# Altium schematic sheet foxbms2-interface-ltc6820.SchDoc
size A3; DocumentNumber: 1; SheetNumber: 1; SheetTotal: 3; SheetDescription: isoSPI Communication
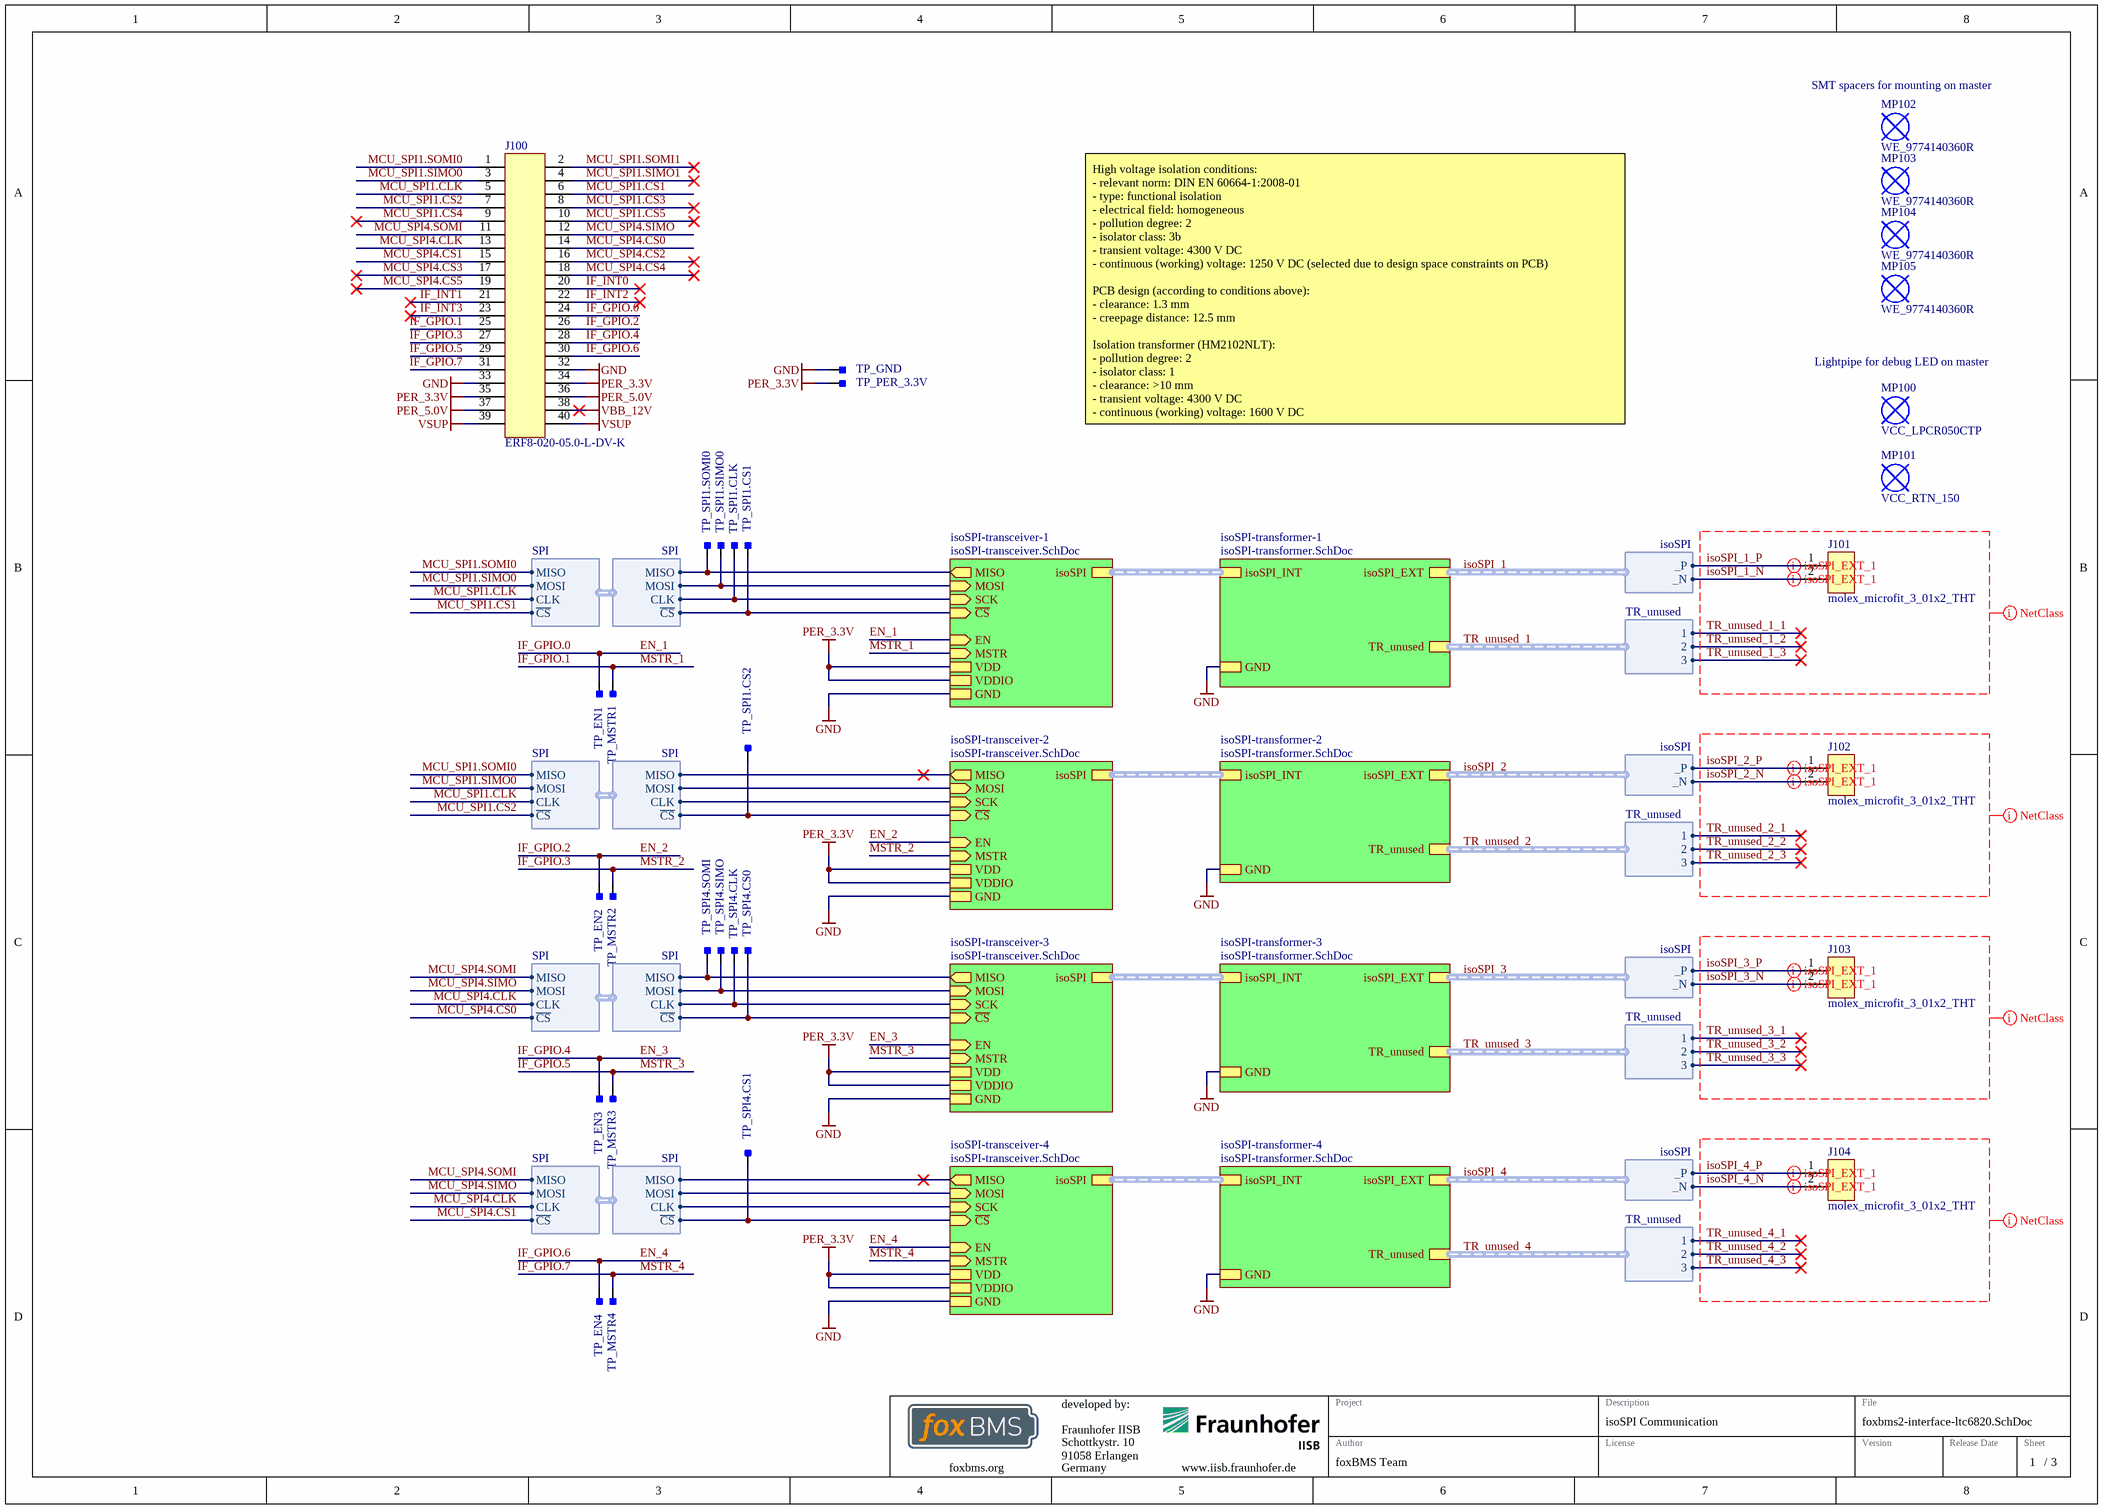
[diagram p0: foxbms2-interface-ltc6820.SchDoc]

## Parts
J100  ERF8-020-05.0-L-DV-K  [SAMTEC_ERF8-020-05.0-L-DV-K]
J101  molex_microfit_3_01x2_THT  [MOLEX_MICROFIT_01x2_THT]
J102  molex_microfit_3_01x2_THT  [MOLEX_MICROFIT_01x2_THT]
J103  molex_microfit_3_01x2_THT  [MOLEX_MICROFIT_01x2_THT]
J104  molex_microfit_3_01x2_THT  [MOLEX_MICROFIT_01x2_THT]
MP100  VCC_LPCR050CTP  [VCC_LPCR050TP]  (mechanical)
MP101  VCC_RTN_150  [VCC_RTN_150]  (mechanical)
MP102  WE_9774140360R  [WE_9774140360]
MP103  WE_9774140360R  [WE_9774140360]
MP104  WE_9774140360R  [WE_9774140360]
MP105  WE_9774140360R  [WE_9774140360]
TP_EN1  Testpoint_Square  [Testpoint_S1]  (value not drawn)  (no BOM)
TP_EN2  Testpoint_Square  [Testpoint_S1]  (value not drawn)  (no BOM)
TP_EN3  Testpoint_Square  [Testpoint_S1]  (value not drawn)  (no BOM)
TP_EN4  Testpoint_Square  [Testpoint_S1]  (value not drawn)  (no BOM)
TP_GND  Testpoint_Square  [Testpoint_S1]  (value not drawn)  (no BOM)
TP_MSTR1  Testpoint_Square  [Testpoint_S1]  (value not drawn)  (no BOM)
TP_MSTR2  Testpoint_Square  [Testpoint_S1]  (value not drawn)  (no BOM)
TP_MSTR3  Testpoint_Square  [Testpoint_S1]  (value not drawn)  (no BOM)
TP_MSTR4  Testpoint_Square  [Testpoint_S1]  (value not drawn)  (no BOM)
TP_PER_3.3V  Testpoint_Square  [Testpoint_S1]  (value not drawn)  (no BOM)
TP_SPI1.CLK  Testpoint_Square  [Testpoint_S1]  (value not drawn)  (no BOM)
TP_SPI1.CS1  Testpoint_Square  [Testpoint_S1]  (value not drawn)  (no BOM)
TP_SPI1.CS2  Testpoint_Square  [Testpoint_S1]  (value not drawn)  (no BOM)
TP_SPI1.SIMO0  Testpoint_Square  [Testpoint_S1]  (value not drawn)  (no BOM)
TP_SPI1.SOMI0  Testpoint_Square  [Testpoint_S1]  (value not drawn)  (no BOM)
TP_SPI4.CLK  Testpoint_Square  [Testpoint_S1]  (value not drawn)  (no BOM)
TP_SPI4.CS0  Testpoint_Square  [Testpoint_S1]  (value not drawn)  (no BOM)
TP_SPI4.CS1  Testpoint_Square  [Testpoint_S1]  (value not drawn)  (no BOM)
TP_SPI4.SIMO  Testpoint_Square  [Testpoint_S1]  (value not drawn)  (no BOM)
TP_SPI4.SOMI  Testpoint_Square  [Testpoint_S1]  (value not drawn)  (no BOM)

## Sub-sheets
isoSPI-transceiver-1 = isoSPI-transceiver.SchDoc: GND, VDDIO, MISO (out), SCK (in), EN (in), ~{CS} (in), VDD, MOSI (in), MSTR (in), isoSPI (harness isoSPI)
isoSPI-transceiver-2 = isoSPI-transceiver.SchDoc: GND, VDDIO, MISO (out), SCK (in), EN (in), ~{CS} (in), VDD, MOSI (in), MSTR (in), isoSPI (harness isoSPI)
isoSPI-transceiver-3 = isoSPI-transceiver.SchDoc: GND, VDDIO, MISO (out), SCK (in), EN (in), ~{CS} (in), VDD, MOSI (in), MSTR (in), isoSPI (harness isoSPI)
isoSPI-transceiver-4 = isoSPI-transceiver.SchDoc: GND, VDDIO, MISO (out), SCK (in), EN (in), ~{CS} (in), VDD, MOSI (in), MSTR (in), isoSPI (harness isoSPI)
isoSPI-transformer-1 = isoSPI-transformer.SchDoc: GND, isoSPI_INT (harness isoSPI), isoSPI_EXT (harness isoSPI), TR_unused (harness TR_unused)
isoSPI-transformer-2 = isoSPI-transformer.SchDoc: GND, isoSPI_INT (harness isoSPI), isoSPI_EXT (harness isoSPI), TR_unused (harness TR_unused)
isoSPI-transformer-3 = isoSPI-transformer.SchDoc: GND, isoSPI_INT (harness isoSPI), isoSPI_EXT (harness isoSPI), TR_unused (harness TR_unused)
isoSPI-transformer-4 = isoSPI-transformer.SchDoc: GND, isoSPI_INT (harness isoSPI), isoSPI_EXT (harness isoSPI), TR_unused (harness TR_unused)

## Harnesses
SPI: CLK, MOSI, MISO, ~{CS}
isoSPI: _P, _N
TR_unused: 1, 2, 3

## Nets
GND: J100.32 J100.33 TP_GND.1 ; sheet isoSPI-transceiver-1/GND, sheet isoSPI-transformer-1/GND, sheet isoSPI-transceiver-2/GND, sheet isoSPI-transformer-2/GND, sheet isoSPI-transceiver-3/GND, sheet isoSPI-transformer-3/GND, sheet isoSPI-transceiver-4/GND, sheet isoSPI-transformer-4/GND
PER_3.3V: J100.34 J100.35 TP_PER_3.3V.1 ; sheet isoSPI-transceiver-1/VDDIO, sheet isoSPI-transceiver-1/VDD, sheet isoSPI-transceiver-2/VDDIO, sheet isoSPI-transceiver-2/VDD, sheet isoSPI-transceiver-3/VDDIO, sheet isoSPI-transceiver-3/VDD, sheet isoSPI-transceiver-4/VDDIO, sheet isoSPI-transceiver-4/VDD
PER_5.0V: J100.36 J100.37
VBB_12V: J100.38
VSUP: J100.39 J100.40
~{IF_INT0}: J100.20
~{IF_INT1}: J100.21
~{IF_INT2}: J100.22
~{IF_INT3}: J100.23
~{MCU_SPI1.CS1}: J100.6 TP_SPI1.CS1.1 ; sheet isoSPI-transceiver-1/~{CS}, harness SPI.~{CS}
~{MCU_SPI1.CS2}: J100.7 TP_SPI1.CS2.1 ; sheet isoSPI-transceiver-2/~{CS}, harness SPI.~{CS}
~{MCU_SPI1.CS3}: J100.8
~{MCU_SPI1.CS4}: J100.9
~{MCU_SPI1.CS5}: J100.10
~{MCU_SPI4.CS0}: J100.14 TP_SPI4.CS0.1 ; sheet isoSPI-transceiver-3/~{CS}, harness SPI.~{CS}
~{MCU_SPI4.CS1}: J100.15 TP_SPI4.CS1.1 ; sheet isoSPI-transceiver-4/~{CS}, harness SPI.~{CS}
~{MCU_SPI4.CS2}: J100.16
~{MCU_SPI4.CS3}: J100.17
~{MCU_SPI4.CS4}: J100.18
~{MCU_SPI4.CS5}: J100.19
EN_1: J100.24 TP_EN1.1 ; sheet isoSPI-transceiver-1/EN  [also labelled IF_GPIO.0]
EN_2: J100.26 TP_EN2.1 ; sheet isoSPI-transceiver-2/EN  [also labelled IF_GPIO.2]
EN_3: J100.28 TP_EN3.1 ; sheet isoSPI-transceiver-3/EN  [also labelled IF_GPIO.4]
EN_4: J100.30 TP_EN4.1 ; sheet isoSPI-transceiver-4/EN  [also labelled IF_GPIO.6]
IF_GPIO.1: J100.25 TP_MSTR1.1 ; sheet isoSPI-transceiver-1/MSTR  [also labelled MSTR_1]
IF_GPIO.3: J100.27 TP_MSTR2.1 ; sheet isoSPI-transceiver-2/MSTR  [also labelled MSTR_2]
IF_GPIO.5: J100.29 TP_MSTR3.1 ; sheet isoSPI-transceiver-3/MSTR  [also labelled MSTR_3]
IF_GPIO.7: J100.31 TP_MSTR4.1 ; sheet isoSPI-transceiver-4/MSTR  [also labelled MSTR_4]
isoSPI_1_N: J101.2 ; sheet isoSPI-transformer-1/isoSPI_EXT._N  [project net isoSPI_1._N]
isoSPI_1_P: J101.1 ; sheet isoSPI-transformer-1/isoSPI_EXT._P  [project net isoSPI_1._P]
isoSPI_2_N: J102.2 ; sheet isoSPI-transformer-2/isoSPI_EXT._N  [project net isoSPI_2._N]
isoSPI_2_P: J102.1 ; sheet isoSPI-transformer-2/isoSPI_EXT._P  [project net isoSPI_2._P]
isoSPI_3_N: J103.2 ; sheet isoSPI-transformer-3/isoSPI_EXT._N  [project net isoSPI_3._N]
isoSPI_3_P: J103.1 ; sheet isoSPI-transformer-3/isoSPI_EXT._P  [project net isoSPI_3._P]
isoSPI_4_N: J104.2 ; sheet isoSPI-transformer-4/isoSPI_EXT._N  [project net isoSPI_4._N]
isoSPI_4_P: J104.1 ; sheet isoSPI-transformer-4/isoSPI_EXT._P  [project net isoSPI_4._P]
MCU_SPI1.CLK: J100.5 TP_SPI1.CLK.1 ; sheet isoSPI-transceiver-1/SCK, sheet isoSPI-transceiver-2/SCK, harness SPI.CLK
MCU_SPI1.SIMO0: J100.3 TP_SPI1.SIMO0.1 ; sheet isoSPI-transceiver-1/MOSI, sheet isoSPI-transceiver-2/MOSI, harness SPI.MOSI
MCU_SPI1.SIMO1: J100.4
MCU_SPI1.SOMI0: J100.1 TP_SPI1.SOMI0.1 ; sheet isoSPI-transceiver-1/MISO, sheet isoSPI-transceiver-2/MISO, harness SPI.MISO
MCU_SPI1.SOMI1: J100.2
MCU_SPI4.CLK: J100.13 TP_SPI4.CLK.1 ; sheet isoSPI-transceiver-3/SCK, sheet isoSPI-transceiver-4/SCK, harness SPI.CLK
MCU_SPI4.SIMO: J100.12 TP_SPI4.SIMO.1 ; sheet isoSPI-transceiver-3/MOSI, sheet isoSPI-transceiver-4/MOSI, harness SPI.MOSI
MCU_SPI4.SOMI: J100.11 TP_SPI4.SOMI.1 ; sheet isoSPI-transceiver-3/MISO, sheet isoSPI-transceiver-4/MISO, harness SPI.MISO
TR_unused_1_1: sheet isoSPI-transformer-1/TR_unused.1  [project net TR_unused_1.1]
TR_unused_1_2: sheet isoSPI-transformer-1/TR_unused.2  [project net TR_unused_1.2]
TR_unused_1_3: sheet isoSPI-transformer-1/TR_unused.3  [project net TR_unused_1.3]
TR_unused_2_1: sheet isoSPI-transformer-2/TR_unused.1  [project net TR_unused_2.1]
TR_unused_2_2: sheet isoSPI-transformer-2/TR_unused.2  [project net TR_unused_2.2]
TR_unused_2_3: sheet isoSPI-transformer-2/TR_unused.3  [project net TR_unused_2.3]
TR_unused_3_1: sheet isoSPI-transformer-3/TR_unused.1  [project net TR_unused_3.1]
TR_unused_3_2: sheet isoSPI-transformer-3/TR_unused.2  [project net TR_unused_3.2]
TR_unused_3_3: sheet isoSPI-transformer-3/TR_unused.3  [project net TR_unused_3.3]
TR_unused_4_1: sheet isoSPI-transformer-4/TR_unused.1  [project net TR_unused_4.1]
TR_unused_4_2: sheet isoSPI-transformer-4/TR_unused.2  [project net TR_unused_4.2]
TR_unused_4_3: sheet isoSPI-transformer-4/TR_unused.3  [project net TR_unused_4.3]

## Buses and harness runs
harness isoSPI_1 = sheet isoSPI-transformer-1/isoSPI_EXT
harness isoSPI_2 = sheet isoSPI-transformer-2/isoSPI_EXT
harness isoSPI_3 = sheet isoSPI-transformer-3/isoSPI_EXT
harness isoSPI_4 = sheet isoSPI-transformer-4/isoSPI_EXT
harness sheet isoSPI-transceiver-1/isoSPI = sheet isoSPI-transformer-1/isoSPI_INT
harness sheet isoSPI-transceiver-2/isoSPI = sheet isoSPI-transformer-2/isoSPI_INT
harness sheet isoSPI-transceiver-3/isoSPI = sheet isoSPI-transformer-3/isoSPI_INT
harness sheet isoSPI-transceiver-4/isoSPI = sheet isoSPI-transformer-4/isoSPI_INT
harness TR_unused_1 = sheet isoSPI-transformer-1/TR_unused
harness TR_unused_2 = sheet isoSPI-transformer-2/TR_unused
harness TR_unused_3 = sheet isoSPI-transformer-3/TR_unused
harness TR_unused_4 = sheet isoSPI-transformer-4/TR_unused

## Layout directives
net class isoSPI_1: isoSPI_1_N, isoSPI_1_P, TR_unused_1_1, TR_unused_1_2, TR_unused_1_3
net class isoSPI_2: isoSPI_2_N, isoSPI_2_P, TR_unused_2_1, TR_unused_2_2, TR_unused_2_3
net class isoSPI_3: isoSPI_3_N, isoSPI_3_P, TR_unused_3_1, TR_unused_3_2, TR_unused_3_3
net class isoSPI_4: isoSPI_4_N, isoSPI_4_P, TR_unused_4_1, TR_unused_4_2, TR_unused_4_3
differential pair: isoSPI_1._N, isoSPI_1._P, isoSPI_2._N, isoSPI_2._P, isoSPI_3._N, isoSPI_3._P, isoSPI_4._N, isoSPI_4._P

## Notes on the sheet
- (near MP102) SMT spacers for mounting on master
- (near MP100) Lightpipe for debug LED on master
- High voltage isolation conditions:
  - relevant norm: DIN EN 60664-1:2008-01
  - type: functional isolation
  - electrical field: homogeneous
  - pollution degree: 2
  - isolator class: 3b
  - transient voltage: 4300 V DC
  - continuous (working) voltage: 1250 V DC (selected due to design space constraints on PCB)
  PCB design (according to conditions above):
  - clearance: 1.3 mm
  - creepage distance: 12.5 mm
  Isolation transformer (HM2102NLT):
  - pollution degree: 2
  - isolator class: 1
  - clearance: >10 mm
  - transient voltage: 4300 V DC
  - continuous (working) voltage: 1600 V DC
- Fraunhofer IISB
- Schottkystr. 10
- developed by:
- 91058 Erlangen
- Germany
- Author
- Project
- License
- Description
- File
- Version
- Release Date
- Sheet
- foxbms.org <https://foxbms.org>
- www.iisb.fraunhofer.de <https://www.iisb.fraunhofer.de/>
- foxBMS Team
- /

## Library data of the parts
J100 = SAMTEC_ERF8-020-05.0-L-DV-K: Edge Rate rugged high-speed connector strips; Manufacturer: Samtec; Circuits: 40; Automotive Qualified: False; Part Number: SAMTEC_ERF8-020-05.0-L-DV-K; Part Name: ERF8-020-05.0-L-DV-K; Operating Temperature: -55°C - +125°C; ComponentLink1Description: Datasheet; ComponentLink1URL: https://suddendocs.samtec.com/catalog_english/erf8-s.pdf; Supplier 1: Farnell; Supplier Part Number 1: 3771957; Supplier 2: Digikey; Supplier Part Number 2: SAM13550CT-ND; Supplier 3: Mouser; Supplier Part Number 3: 200-ERF802005.0LDVLK; ECCN: EAR99; System: Connector
J101-J104 = molex_microfit_3_01x2_THT: Micro-Fit 3.0 Right Angle Header, 3.00mm Pitch, Dual Row, 2 Circuits, with Snap-in Plastic Peg PCB Lock, Tin, Glow Wire Capable, Black, 43045-0200; Manufacturer: Molex; Circuits: 2; Rated Voltage: 600V; Rated Current: 8.5A; Automotive Qualified: False; Part Number: molex_microfit_3_01x2_THT; Part Name: MicroFit; Operating Temperature: -40°C - +105°C; Supplier 1: Farnell; Supplier Part Number 1: 1012251
MP100 = VCC_LPCR050CTP: Lightpipe Clear LPCR Series; Manufacturer: VCC; Automotive Qualified: False; Part Number: VCC_LPCR050CTP; Part Name: VCC_LPCR050CTP; ComponentLink1Description: Datasheet; ComponentLink1URL: https://vcclite.com/wp-content/uploads/wpallimport/files/files/LPCR.pdf; Supplier 1: Digikey; Supplier Part Number 1: LPCR050CTP-ND; Supplier 2: Mouser; Supplier Part Number 2: 593-LPCR050CTP; ECCN: EAR99
MP101 = VCC_RTN_150: Grommet Retainer for LPC and LPCR Series Light Pipe; Manufacturer: VCC; Automotive Qualified: False; Part Number: VCC_RTN_150; Part Name: VCC_RTN_150; ComponentLink1Description: Datasheet; ComponentLink1URL: https://vcclite.com/?file=files/RTN_150.pdf&file_name=RTN_150.pdf; Supplier 1: Digikey; Supplier Part Number 1: RTN_150-ND; Supplier 2: Mouser; Supplier Part Number 2: 593-RTN150; ECCN: EAR99
MP102-MP105 = WE_9774140360R: WA-SMSI SMT Steel Spacer with internal thread M 3; Manufacturer: Würth Elektronik; Automotive Qualified: False; Part Number: WE_9774140360R; Part Name: WE_9774140360R; Operating Temperature: -55°C - +150°C; ComponentLink1Description: Datasheet; ComponentLink1URL: https://www.we-online.com/catalog/datasheet/9774140360R.pdf; Supplier 1: Digikey; Supplier Part Number 1: 732-5281-1-ND; Supplier 2: Mouser; Supplier Part Number 2: 710-9774140360R; ECCN: EAR99
TP_EN1-TP_EN4 TP_GND TP_MSTR1-TP_MSTR4 TP_PER_3.3V TP_SPI1.CLK TP_SPI1.CS1 TP_SPI1.CS2 TP_SPI1.SIMO0 TP_SPI1.SOMI0 TP_SPI4.CLK TP_SPI4.CS0 TP_SPI4.CS1 TP_SPI4.SIMO TP_SPI4.SOMI = Testpoint_Square: Testpoint, square; Automotive Qualified: False; Part Number: Testpoint_Square